# EAGLE design interconnect-board (EAGLE 7.6.0)
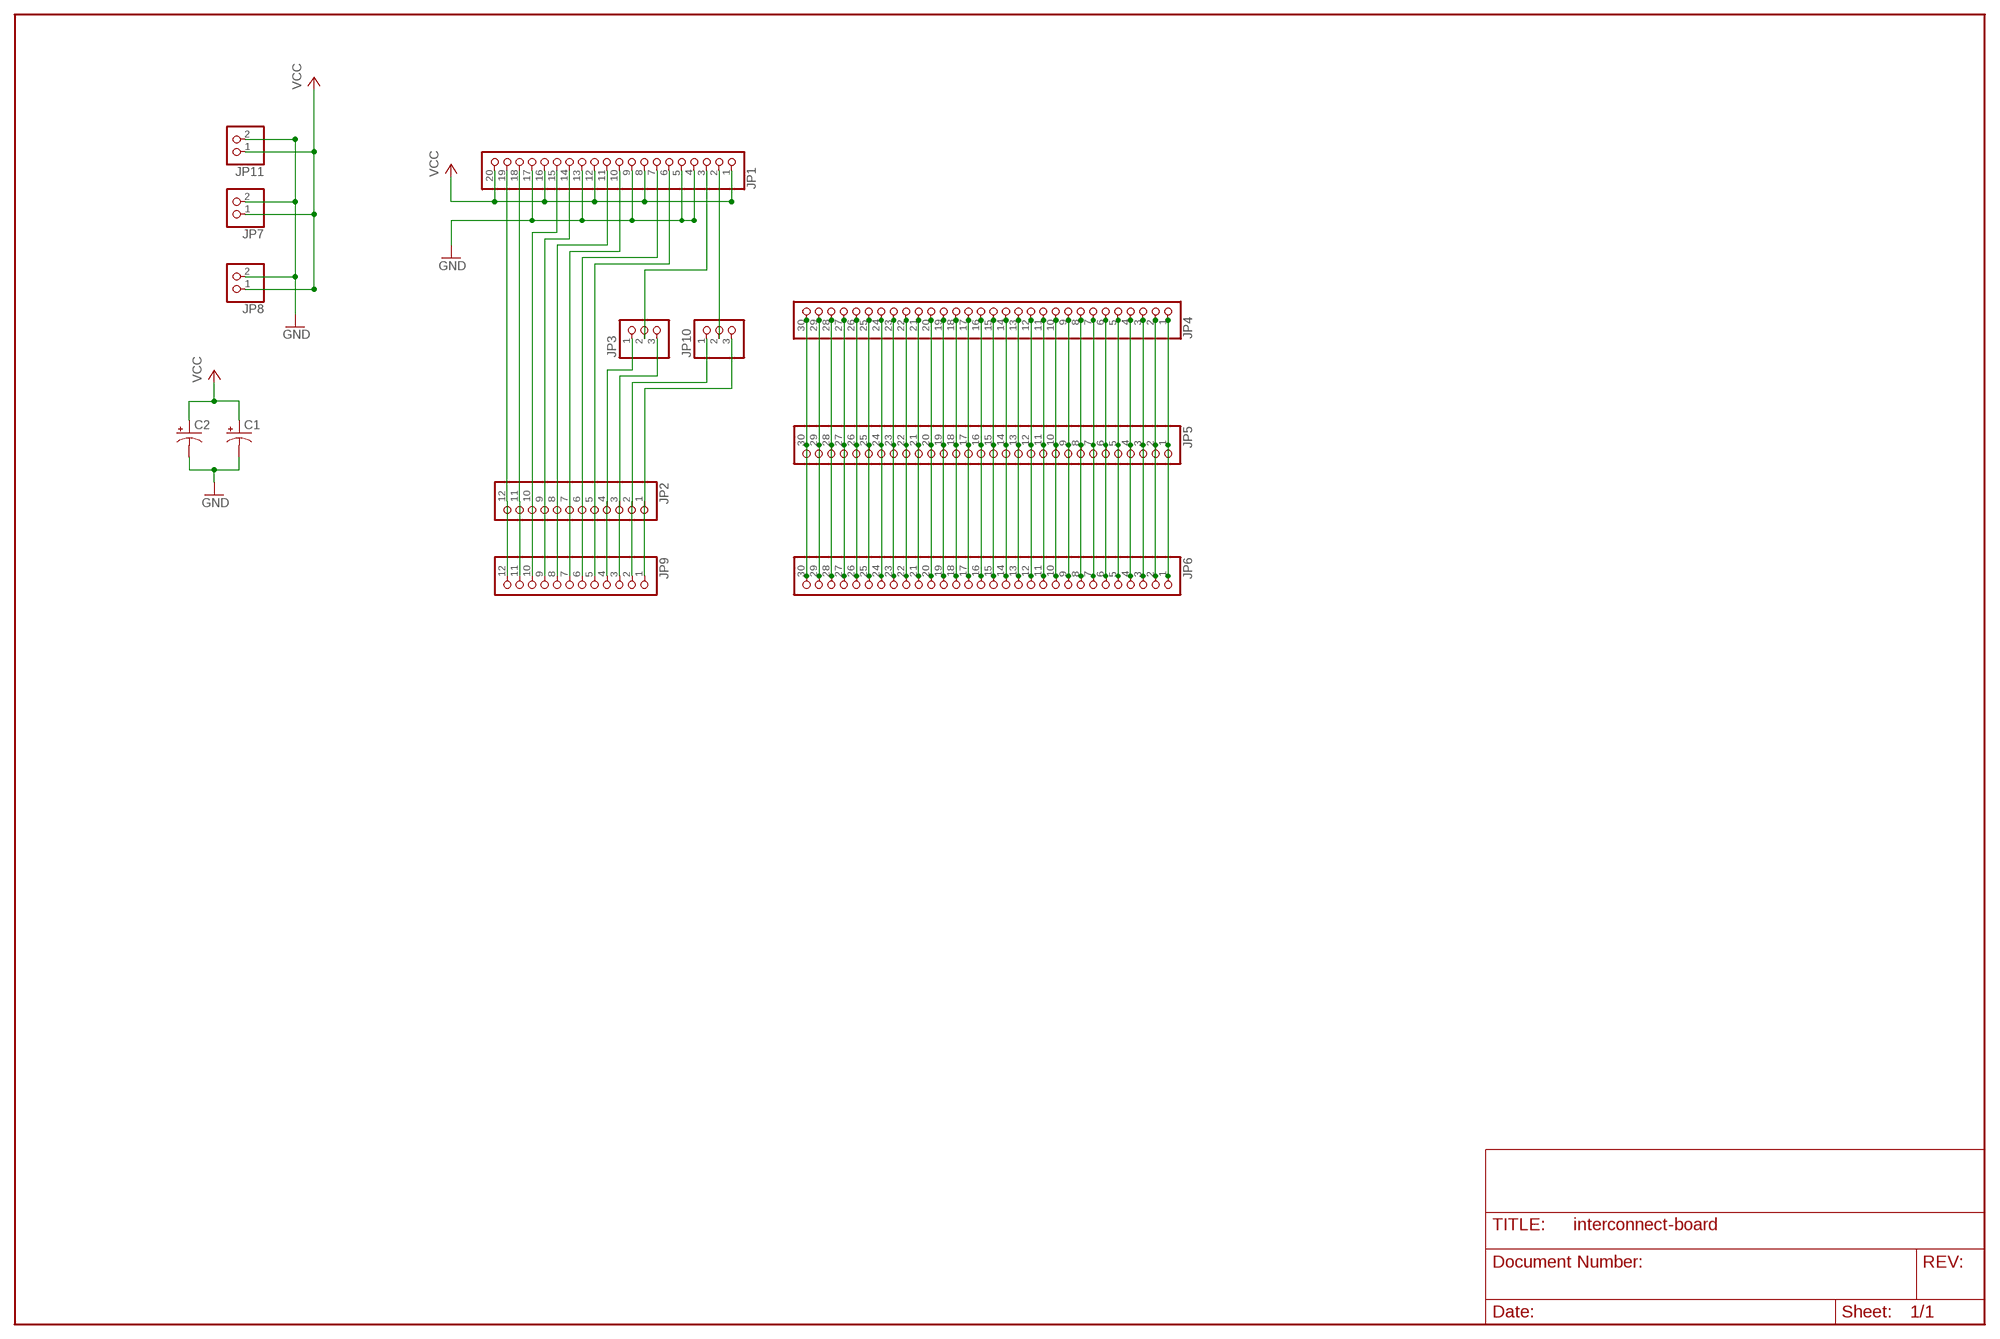
[diagram p0: schematic, sheet 1]

## Parts
C1  CPOL-USE15-6AXIAL  [E15-6]
C2  CPOL-USE15-6AXIAL  [E15-6]
JP1  PINHD-1X20  [1X20]
JP2  PINHD-1X12  [1X12]
JP3  PINHD-1X3  [1X03]
JP4  PINHD-1X30  [1X30]
JP5  PINHD-1X30  [1X30]
JP6  PINHD-1X30  [1X30]
JP7  PINHD-1X2  [1X02]
JP8  PINHD-1X2  [1X02]
JP9  PINHD-1X12  [1X12]
JP10  PINHD-1X3  [1X03]
JP11  PINHD-1X2  [1X02]

## Nets
GND: C1.- C2.- JP1.4 JP1.5 JP1.9 JP1.13 JP1.17 JP7.2 JP8.2 JP11.2
N$1: JP4.30 JP5.30 JP6.30
N$2: JP4.29 JP5.29 JP6.29
N$3: JP4.28 JP5.28 JP6.28
N$4: JP4.27 JP5.27 JP6.27
N$5: JP4.26 JP5.26 JP6.26
N$6: JP4.25 JP5.25 JP6.25
N$7: JP4.24 JP5.24 JP6.24
N$8: JP4.23 JP5.23 JP6.23
N$9: JP4.22 JP5.22 JP6.22
N$10: JP4.21 JP5.21 JP6.21
N$11: JP4.20 JP5.20 JP6.20
N$12: JP4.19 JP5.19 JP6.19
N$13: JP4.18 JP5.18 JP6.18
N$14: JP4.17 JP5.17 JP6.17
N$15: JP4.16 JP5.16 JP6.16
N$16: JP4.15 JP5.15 JP6.15
N$17: JP4.14 JP5.14 JP6.14
N$18: JP4.13 JP5.13 JP6.13
N$19: JP4.12 JP5.12 JP6.12
N$20: JP4.11 JP5.11 JP6.11
N$21: JP4.10 JP5.10 JP6.10
N$22: JP4.9 JP5.9 JP6.9
N$23: JP4.8 JP5.8 JP6.8
N$24: JP4.7 JP5.7 JP6.7
N$25: JP4.6 JP5.6 JP6.6
N$26: JP4.5 JP5.5 JP6.5
N$27: JP4.4 JP5.4 JP6.4
N$28: JP4.3 JP5.3 JP6.3
N$29: JP4.2 JP5.2 JP6.2
N$30: JP4.1 JP5.1 JP6.1
N$31: JP1.19 JP2.12 JP9.12
N$32: JP1.18 JP2.11 JP9.11
N$33: JP1.15 JP2.10 JP9.10
N$34: JP1.14 JP2.9 JP9.9
N$35: JP1.11 JP2.8 JP9.8
N$36: JP1.10 JP2.7 JP9.7
N$37: JP1.7 JP2.6 JP9.6
N$38: JP1.6 JP2.5 JP9.5
N$39: JP2.4 JP3.1 JP9.4
N$40: JP2.3 JP3.3 JP9.3
N$41: JP2.2 JP9.2 JP10.1
N$43: JP1.3 JP3.2
N$44: JP1.2 JP10.2
N$46: JP2.1 JP9.1 JP10.3
VCC: C1.+ C2.+ JP1.1 JP1.8 JP1.12 JP1.16 JP1.20 JP7.1 JP8.1 JP11.1

## Library data of the parts
C1 C2 = resistor:CPOL-US: POLARIZED CAPACITOR, American symbol
JP1 = pinhead:PINHD-1X20: PIN HEADER
JP2 JP9 = pinhead:PINHD-1X12: PIN HEADER
JP3 JP10 = pinhead:PINHD-1X3: PIN HEADER
JP4-JP6 = pinhead:PINHD-1X30: PIN HEADER
JP7 JP8 JP11 = pinhead:PINHD-1X2: PIN HEADER

## Board
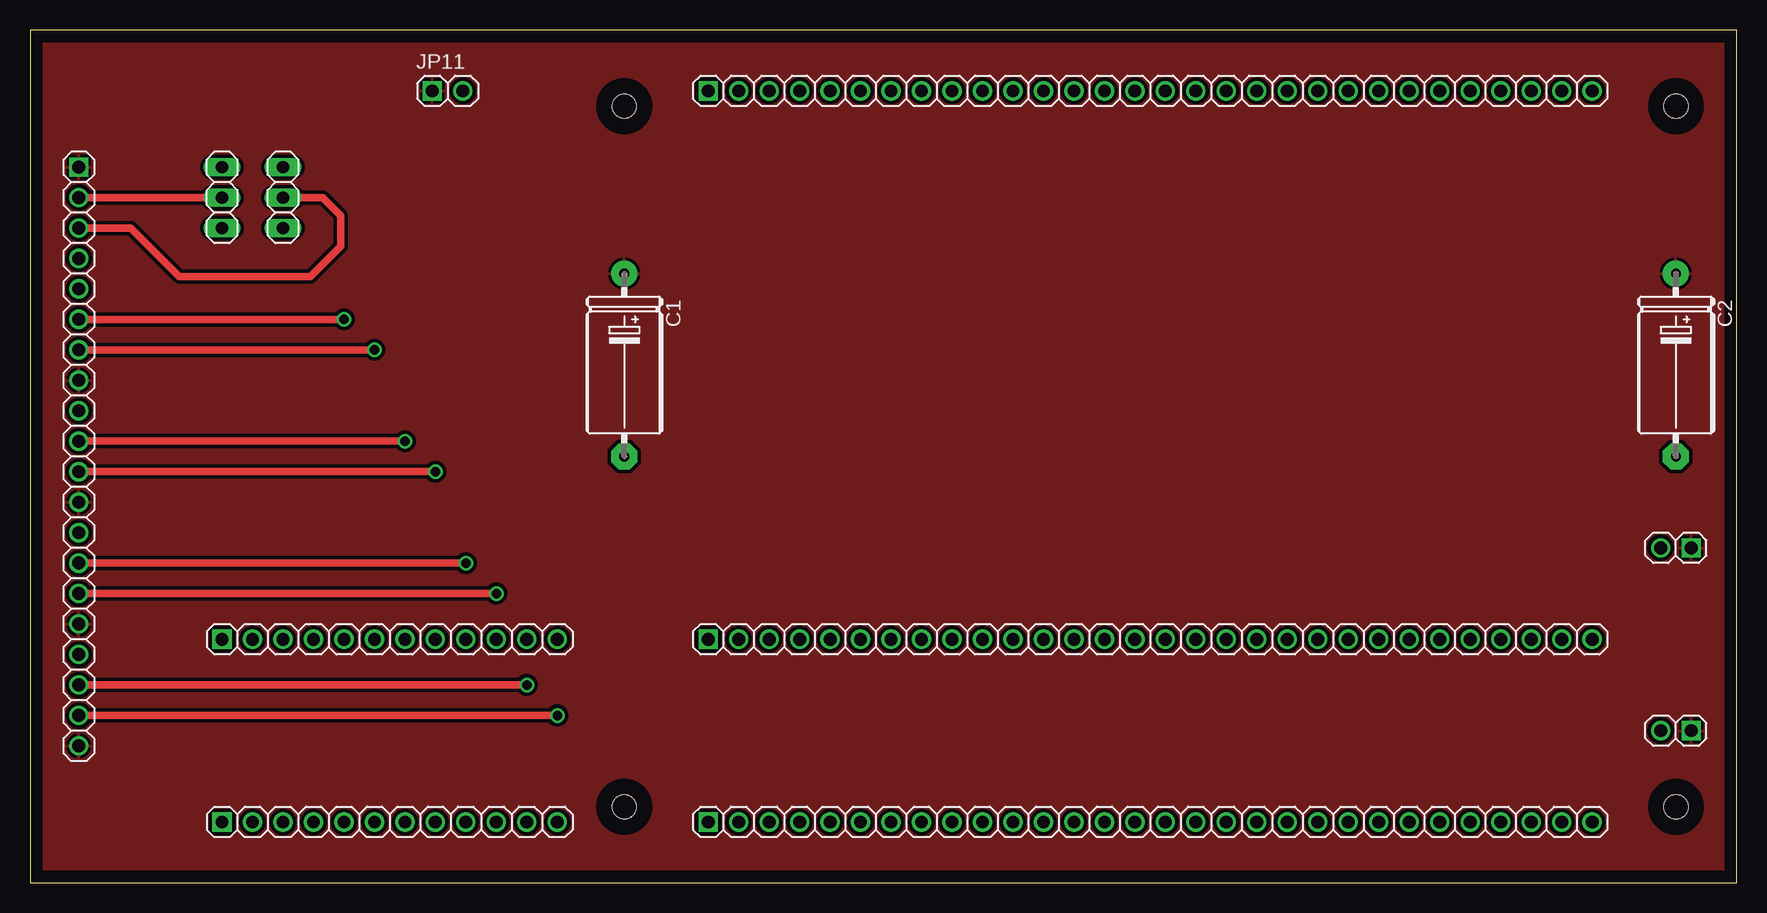
[diagram p1: board, top side]
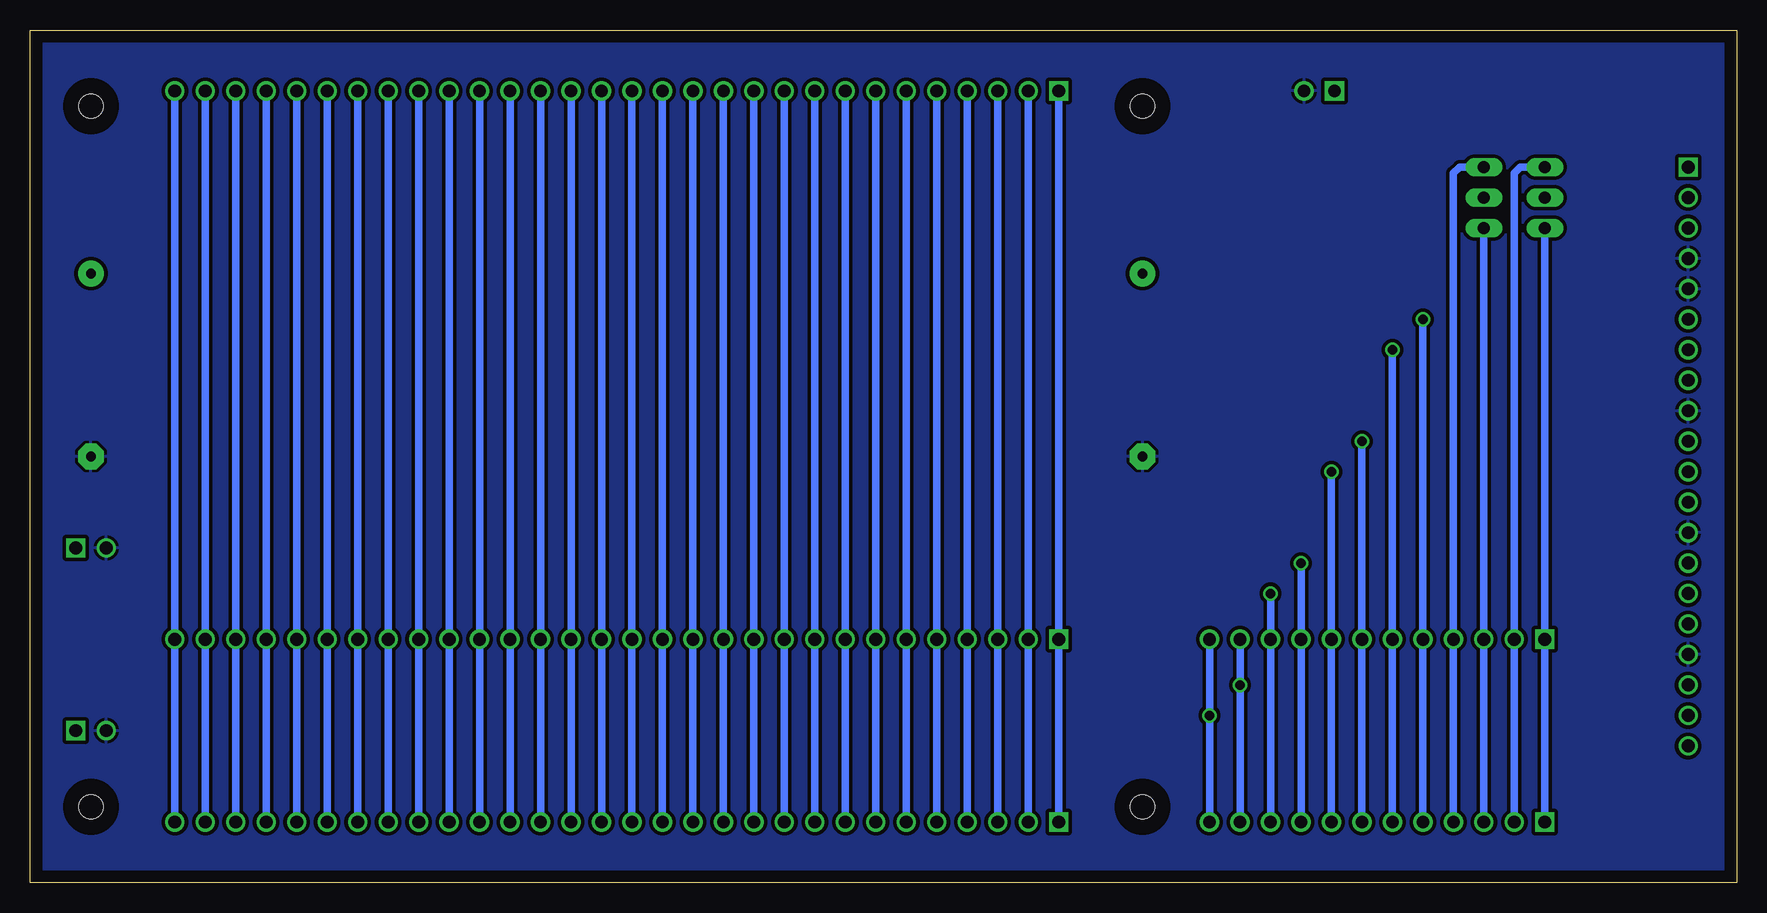
[diagram p2: board, bottom side, seen from below]

Size 142.24 x 71.12 mm. Coordinates in mm from the lower left corner, seen from the top.
Outline: 0,0 142.24,0 142.24,71.12 0,71.12 0,0
Copper layers (1*16): Top 0.035mm / dielectric 1.5mm / Bottom 0.035mm
Design rules "default": minimum track width 10mil, minimum drill 24mil, track to track 8mil, track to pad 8mil, pad to pad 8mil, via to via 8mil, smd to smd 8mil, copper to edge 40mil, drill to drill 8mil, minimum pad ring 10mil, minimum via ring 8mil, stop-mask expansion 4mil, vias tented up to drill 0mil, thermal gap 10mil
Holes 2.01 mm at 49.53,64.77 137.16,64.77 49.53,6.35 137.16,6.35
tRestrict: area 47.5,62.8 to 51.5,66.8; area 135.2,62.8 to 139.2,66.8; area 47.5,4.3 to 51.5,8.4; area 135.2,4.3 to 139.2,8.4
bRestrict: area 47.5,62.8 to 51.5,66.8; area 135.2,62.8 to 139.2,66.8; area 47.5,4.3 to 51.5,8.4; area 135.2,4.3 to 139.2,8.4

### Footprints (pad centres in the part's own frame; a part is rotated, then mirrored left to right if it is on the bottom)
E15-6 = drill 0.813 pad 2.159: + -7.62,0 | drill 0.813 pad 2.159 octagon: - 7.62,0
1X20 = drill 1.067 square: 1 -24.13,0 | drill 1.067: 2 -21.59,0; 3 -19.05,0; 4 -16.51,0; 5 -13.97,0; 6 -11.43,0; 7 -8.89,0; 8 -6.35,0; 9 -3.81,0; 10 -1.27,0; 11 1.27,0; 12 3.81,0; 13 6.35,0; 14 8.89,0; 15 11.43,0; 16 13.97,0; 17 16.51,0; 18 19.05,0; 19 21.59,0; 20 24.13,0
1X12 = drill 1.067 square: 1 -13.97,0 | drill 1.067: 2 -11.43,0; 3 -8.89,0; 4 -6.35,0; 5 -3.81,0; 6 -1.27,0; 7 1.27,0; 8 3.81,0; 9 6.35,0; 10 8.89,0; 11 11.43,0; 12 13.97,0
1X03 = drill 1.016 long: 1 -2.54,0; 2 0,0; 3 2.54,0
1X30 = drill 1.067 square: 1 -36.83,0 | drill 1.067: 2 -34.29,0; 3 -31.75,0; 4 -29.21,0; 5 -26.67,0; 6 -24.13,0; 7 -21.59,0; 8 -19.05,0; 9 -16.51,0; 10 -13.97,0; 11 -11.43,0; 12 -8.89,0; 13 -6.35,0; 14 -3.81,0; 15 -1.27,0; 16 1.27,0; 17 3.81,0; 18 6.35,0; 19 8.89,0; 20 11.43,0; 21 13.97,0; 22 16.51,0; 23 19.05,0; 24 21.59,0; 25 24.13,0; 26 26.67,0; 27 29.21,0; 28 31.75,0; 29 34.29,0; 30 36.83,0
1X02 = drill 1.067 square: 1 -1.27,0 | drill 1.067: 2 1.27,0

### Placement (x,y rotation side)
C1  49.53,43.18 270 top
C2  137.16,43.18 270 top
JP1  4.06,35.56 270 top
JP2  29.97,5.08 0 top
JP3  21.08,57.15 270 top
JP4  93.34,66.04 0 top
JP5  93.34,5.08 0 top
JP6  93.34,20.32 0 top
JP7  137.16,12.7 180 top
JP8  137.16,27.94 180 top
JP9  29.97,20.32 0 top
JP10  16,57.15 270 top
JP11  34.8,66.04 0 top

### Tracks (layer width: path | path; a pad name or v marks a point on that pad's centre or on a via)
GND
  pour Bottom (isolate 0.305): 0,0 142.24,0 142.24,71.12 0,71.12
N$1
  Bottom 0.61: JP5.30 JP6.30 JP4.30
N$2
  Bottom 0.61: JP5.29 JP6.29 JP4.29
N$3
  Bottom 0.61: JP5.28 JP6.28 JP4.28
N$4
  Bottom 0.61: JP5.27 JP6.27 JP4.27
N$5
  Bottom 0.61: JP5.26 JP6.26 JP4.26
N$6
  Bottom 0.61: JP5.25 JP6.25 JP4.25
N$7
  Bottom 0.61: JP5.24 JP6.24 JP4.24
N$8
  Bottom 0.61: JP5.23 JP6.23 JP4.23
N$9
  Bottom 0.61: JP5.22 JP6.22 JP4.22
N$10
  Bottom 0.61: JP5.21 JP6.21 JP4.21
N$11
  Bottom 0.61: JP5.20 JP6.20 JP4.20
N$12
  Bottom 0.61: JP5.19 JP6.19 JP4.19
N$13
  Bottom 0.61: JP5.18 JP6.18 JP4.18
N$14
  Bottom 0.61: JP5.17 JP6.17 JP4.17
N$15
  Bottom 0.61: JP5.16 JP6.16 JP4.16
N$16
  Bottom 0.61: JP5.15 JP6.15 JP4.15
N$17
  Bottom 0.61: JP5.14 JP6.14 JP4.14
N$18
  Bottom 0.61: JP5.13 JP6.13 JP4.13
N$19
  Bottom 0.61: JP5.12 JP6.12 JP4.12
N$20
  Bottom 0.61: JP5.11 JP6.11 JP4.11
N$21
  Bottom 0.61: JP5.10 JP6.10 JP4.10
N$22
  Bottom 0.61: JP5.9 JP6.9 JP4.9
N$23
  Bottom 0.61: JP5.8 JP6.8 JP4.8
N$24
  Bottom 0.61: JP5.7 JP6.7 JP4.7
N$25
  Bottom 0.61: JP5.6 JP6.6 JP4.6
N$26
  Bottom 0.61: JP5.5 JP6.5 JP4.5
N$27
  Bottom 0.61: JP5.4 JP6.4 JP4.4
N$28
  Bottom 0.61: JP4.3 JP6.3 JP5.3
N$29
  Bottom 0.61: JP5.2 JP6.2 JP4.2
N$30
  Bottom 0.61: JP4.1 JP6.1 JP5.1
N$31  (via drill 0.8)
  Top 0.61: JP1.19 v43.94,13.97
  Bottom 0.61: JP9.12 v43.94,13.97 JP2.12
N$32  (via drill 0.8)
  Top 0.61: JP1.18 v41.4,16.51
  Bottom 0.61: JP9.11 v41.4,16.51 JP2.11
N$33  (via drill 0.8)
  Top 0.61: JP1.15 v38.86,24.13
  Bottom 0.61: JP2.10 JP9.10 v38.86,24.13
N$34  (via drill 0.8)
  Top 0.61: JP1.14 v36.32,26.67
  Bottom 0.61: JP2.9 JP9.9 v36.32,26.67
N$35  (via drill 0.8)
  Top 0.61: JP1.11 v33.78,34.29
  Bottom 0.61: JP2.8 JP9.8 v33.78,34.29
N$36  (via drill 0.8)
  Top 0.61: JP1.10 v31.24,36.83
  Bottom 0.61: JP2.7 JP9.7 v31.24,36.83
N$37  (via drill 0.8)
  Top 0.61: JP1.7 v28.7,44.45
  Bottom 0.61: JP2.6 JP9.6 v28.7,44.45
N$38  (via drill 0.8)
  Top 0.61: JP1.6 v26.16,46.99
  Bottom 0.61: JP2.5 JP9.5 v26.16,46.99
N$39
  Bottom 0.61: JP2.4 JP9.4 23.62,59.18 23.11,59.69 JP3.1
N$40
  Bottom 0.61: JP3.3 JP9.3 JP2.3
N$41
  Bottom 0.61: JP2.2 JP9.2 18.54,59.18 18.03,59.69 JP10.1
N$43
  Top 0.61: JP1.3 8.38,54.61 12.45,50.55 23.37,50.55 25.91,53.09 25.91,55.63 24.38,57.15 JP3.2
N$44
  Top 0.61: JP1.2 JP10.2
N$46
  Bottom 0.61: JP2.1 JP9.1 JP10.3
VCC
  pour Top (isolate 0.305): 0,0 142.24,0 142.24,71.12 0,71.12

### Text on the board
Document: + | - | + | - | - | + | - | + | - | - | + | + | - | + | http://www.witch-e.org | - | Mini-Store Interconnect Board | +